# EAGLE schematic 8_Channel_Current_Sensor (EAGLE 8.7.0)
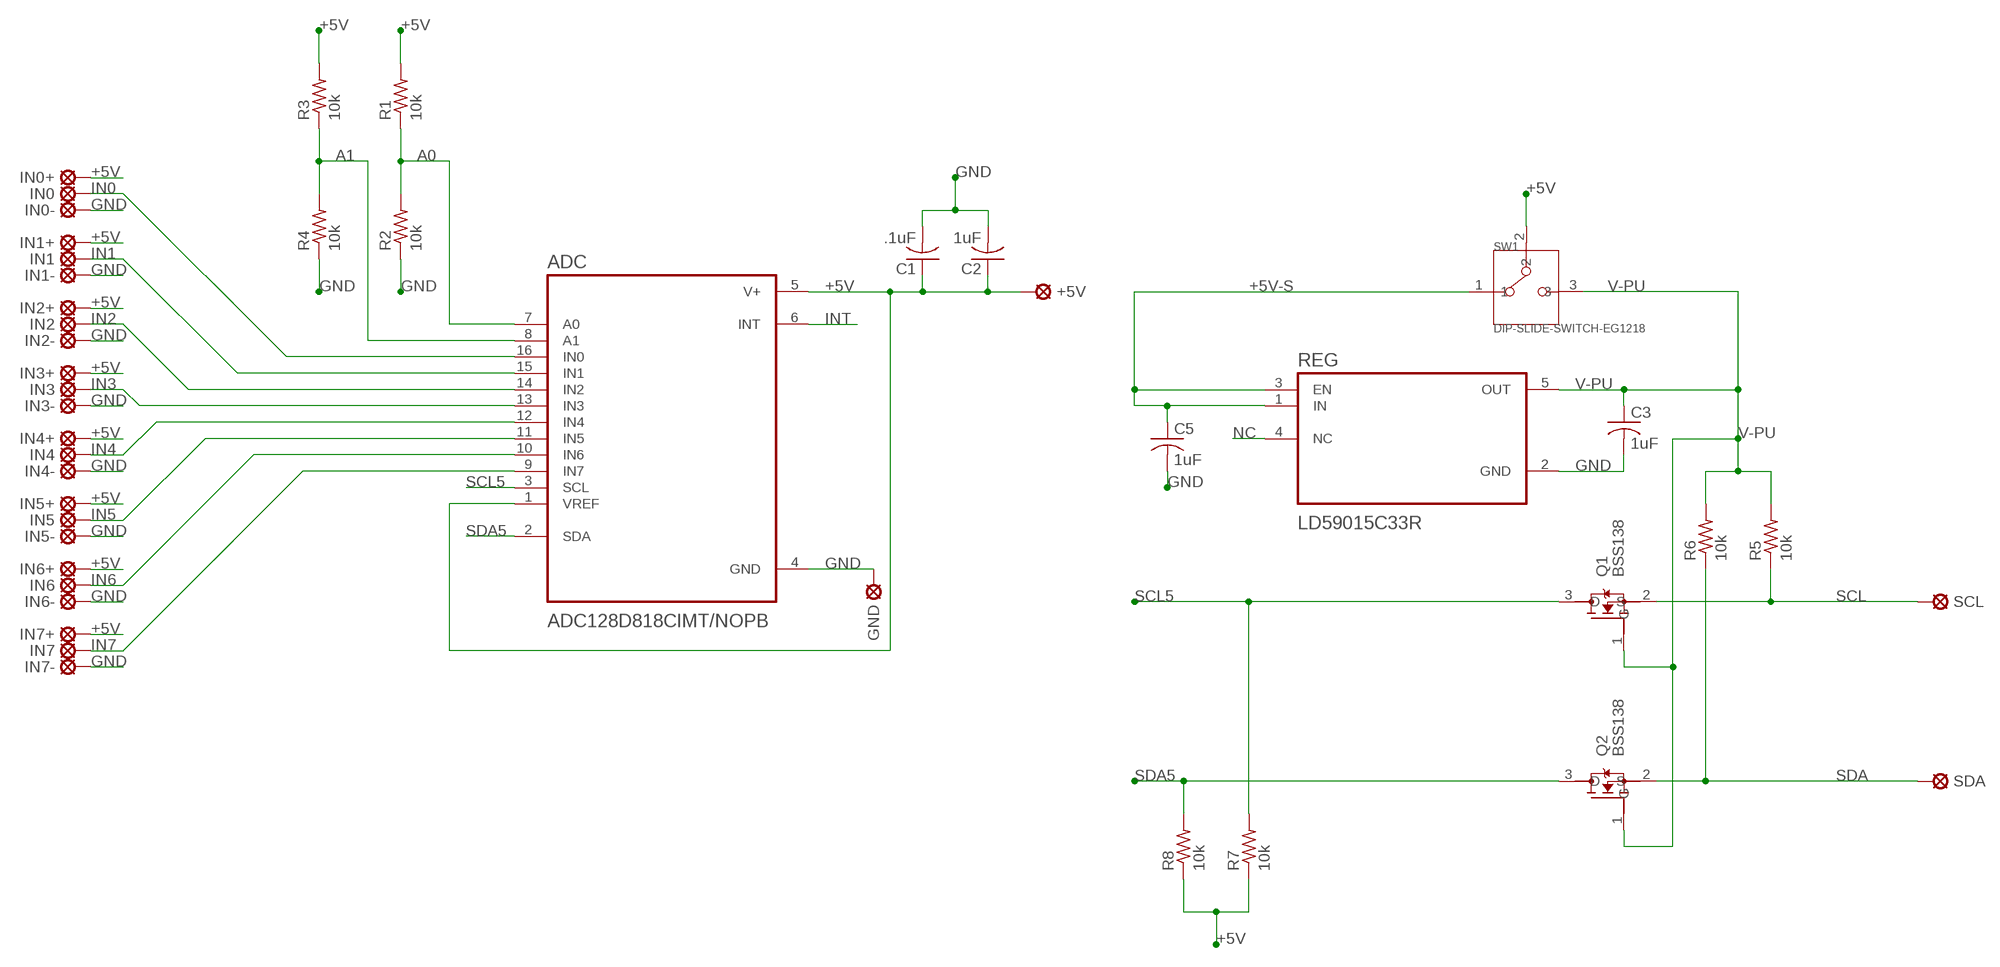
[diagram p0: schematic, sheet 1]

## Parts
+5V  LSP10  [LSP10]
ADC  ADC128D818CIMT/NOPB  [SOP65P640X120-16N]
C1  .1uF  C-USC0603  [C0603]
C2  1uF  C-USC0603  [C0603]
C3  1uF  C-USC0603  [C0603]
C5  1uF  C-USC0603  [C0603]
GND  LSP10  [LSP10]
IN0  LSP10  [LSP10]
IN0+  LSP10  [LSP10]
IN0-  LSP10  [LSP10]
IN1  LSP10  [LSP10]
IN1+  LSP10  [LSP10]
IN1-  LSP10  [LSP10]
IN2  LSP10  [LSP10]
IN2+  LSP10  [LSP10]
IN2-  LSP10  [LSP10]
IN3  LSP10  [LSP10]
IN3+  LSP10  [LSP10]
IN3-  LSP10  [LSP10]
IN4  LSP10  [LSP10]
IN4+  LSP10  [LSP10]
IN4-  LSP10  [LSP10]
IN5  LSP10  [LSP10]
IN5+  LSP10  [LSP10]
IN5-  LSP10  [LSP10]
IN6  LSP10  [LSP10]
IN6+  LSP10  [LSP10]
IN6-  LSP10  [LSP10]
IN7  LSP10  [LSP10]
IN7+  LSP10  [LSP10]
IN7-  LSP10  [LSP10]
Q1  BSS138  [SOT95P240X120-3N]
Q2  BSS138  [SOT95P240X120-3N]
R1  10k  R-US_R0603  [R0603]
R2  10k  R-US_R0603  [R0603]
R3  10k  R-US_R0603  [R0603]
R4  10k  R-US_R0603  [R0603]
R5  10k  R-US_R0603  [R0603]
R6  10k  R-US_R0603  [R0603]
R7  10k  R-US_R0603  [R0603]
R8  10k  R-US_R0603  [R0603]
REG  LD59015C33R  [SOT65P210X110-5N]
SCL  LSP10  [LSP10]
SDA  LSP10  [LSP10]
SW1  DIP-SLIDE-SWITCH-EG1218  [SW3-2.5-11.6X4.0X5.4+2.0MM]

## Nets
+5V: +5V.MP ADC.1(VREF) ADC.5(V+) C1.1 C2.1 IN0+.MP IN1+.MP IN2+.MP IN3+.MP IN4+.MP IN5+.MP IN6+.MP IN7+.MP R1.2 R3.2 R7.1 R8.1 SW1.2
+5V-S: C5.1 REG.1(IN) REG.3(EN) SW1.1
A0: ADC.7(A0) R1.1 R2.2
A1: ADC.8(A1) R3.1 R4.2
GND: ADC.4(GND) C1.2 C2.2 C3.2 C5.2 GND.MP IN0-.MP IN1-.MP IN2-.MP IN3-.MP IN4-.MP IN5-.MP IN6-.MP IN7-.MP R2.1 R4.1 REG.2(GND)
IN0: ADC.16(IN0) IN0.MP
IN1: ADC.15(IN1) IN1.MP
IN2: ADC.14(IN2) IN2.MP
IN3: ADC.13(IN3) IN3.MP
IN4: ADC.12(IN4) IN4.MP
IN5: ADC.11(IN5) IN5.MP
IN6: ADC.10(IN6) IN6.MP
IN7: ADC.9(IN7) IN7.MP
INT: ADC.6(INT)
NC: REG.4(NC)
SCL: Q1.2(S) R5.1 SCL.MP
SCL5: ADC.3(SCL) Q1.3(D) R7.2
SDA: Q2.2(S) R6.1 SDA.MP
SDA5: ADC.2(SDA) Q2.3(D) R8.2
V-PU: C3.1 Q1.1(G) Q2.1(G) R5.2 R6.2 REG.5(OUT) SW1.3

## Library data of the parts
+5V GND IN0 IN0+ IN0- IN1 IN1+ IN1- IN2 IN2+ IN2- IN3 IN3+ IN3- IN4 IN4+ IN4- IN5 IN5+ IN5- IN6 IN6+ IN6- IN7 IN7+ IN7- SCL SDA = solpad:LSP10: SOLDER PAD drill 1.0 mm, distributor Buerklin, 12H555
ADC = ADC128D818CIMT_NOPB:ADC128D818CIMT/NOPB: None; AVAILABILITY: Good; DESCRIPTION: 12-Bit, 8-Channel, ADC System Monitor w/ Temp Sensor, Internal/External Reference, & I2C Interface 16-TSSOP -40 to 125; MF: Texas Instruments; MP: ADC128D818CIMT/NOPB; PACKAGE: TSSOP-16 Texas Instruments; PRICE: 3.94 USD
C1-C3 C5 = resistor:C-US: CAPACITOR, American symbol
Q1 Q2 = BSS138:BSS138: B138 Series 50 V 6 Ohms N-Ch Logic Level Enhancement Mode FET - SOT-23-3; AVAILABILITY: Good; DESCRIPTION: 50V N-Channel Logic Level Enhancement Mode Field Effect Transistor; MF: ON Semiconductor; MP: BSS138; PACKAGE: SOT-23 ON Semiconductor; PRICE: 0.09 USD
R1-R8 = resistor:R-US_: RESISTOR, American symbol
REG = LD59015C33R:LD59015C33R: None; AVAILABILITY: Good; DESCRIPTION: LD59015 Series 150 mA 3.3 V Fixed High PSRR LDO Voltage Regulator - SOT-323-5; MF: STMicroelectronics; MP: LD59015C33R; PACKAGE: SOT-323 STMicroelectronics; PRICE: 0.44 USD
SW1 = EG1218-DIP-SLIDE-SWITCH:DIP-SLIDE-SWITCH: 311010006; AVAILABILITY: Good; DESCRIPTION: EG Series SPDT On-On Vertical Through Hole Slide Switch; MF: E-Switch; MP: EG1218; PACKAGE: FakePackage u; PRICE: 0.41 USD